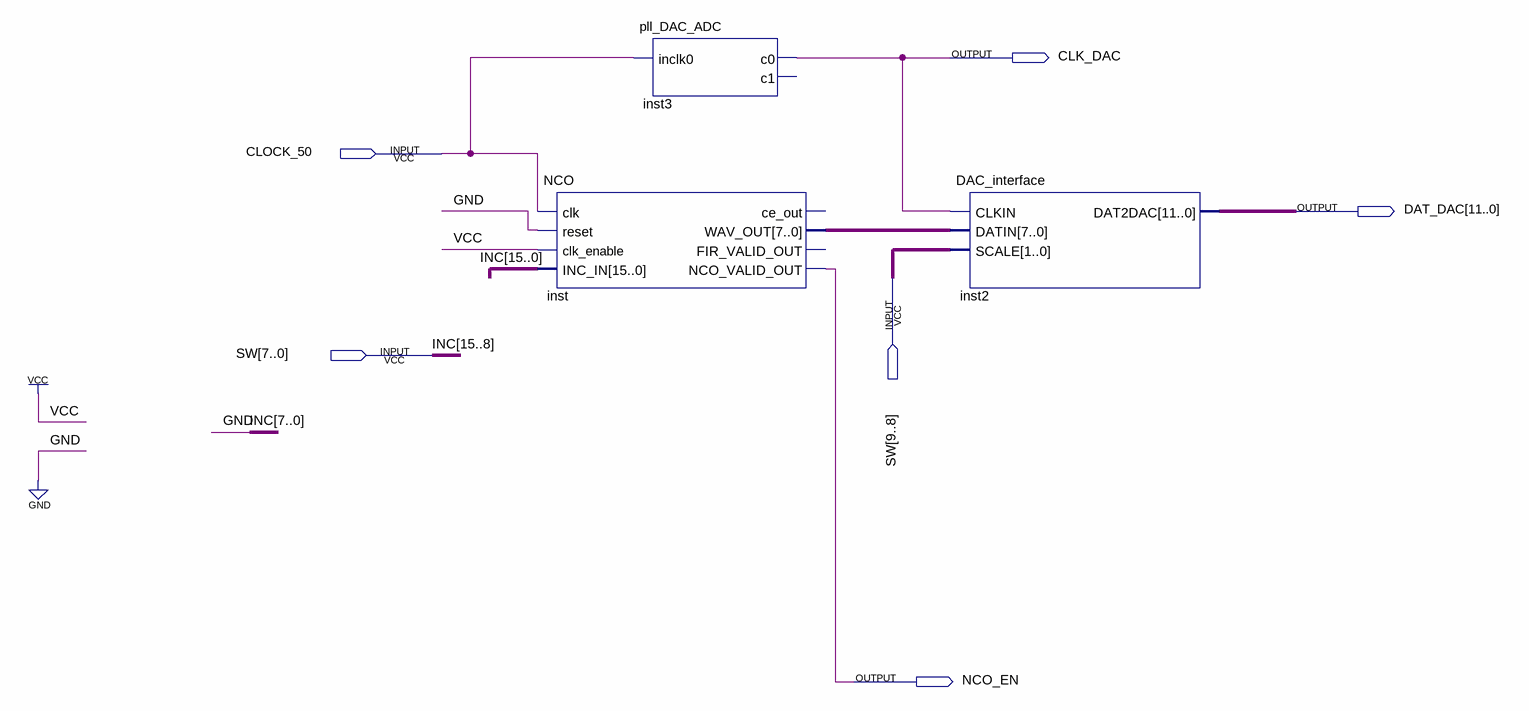
[diagram p0: schematic sheet]
// Quartus schematic NCO_quartus.bdf as structural Verilog: 3 symbols, 6 pins
module NCO_quartus (
  input  CLOCK_50,
  input  [9:0] SW,
  output CLK_DAC,
  output [11:0] DAT_DAC,
  output NCO_EN
);

  wire [7:0] INC, inst_wav_out;

  NCO inst (
    .clk(CLOCK_50), .reset(1'b0), .clk_enable(1'b1), .INC_IN({SW[7:0], INC}), .WAV_OUT(inst_wav_out),
    .NCO_VALID_OUT(NCO_EN));  // open: ce_out, FIR_VALID_OUT
  pll_DAC_ADC inst3 (.inclk0(CLOCK_50), .c0(CLK_DAC));  // open: c1
  DAC_interface inst2 (.CLKIN(CLK_DAC), .DATIN(inst_wav_out), .SCALE(SW[9:8]), .DAT2DAC(DAT_DAC));

  // Other names for the same wires on the sheet: INC[15:8] = SW[7:0]
endmodule
